# EAGLE schematic AutoPad-R3-RevA (EAGLE 9.5.2), part 1 of 3

## Sheet 1 of 12
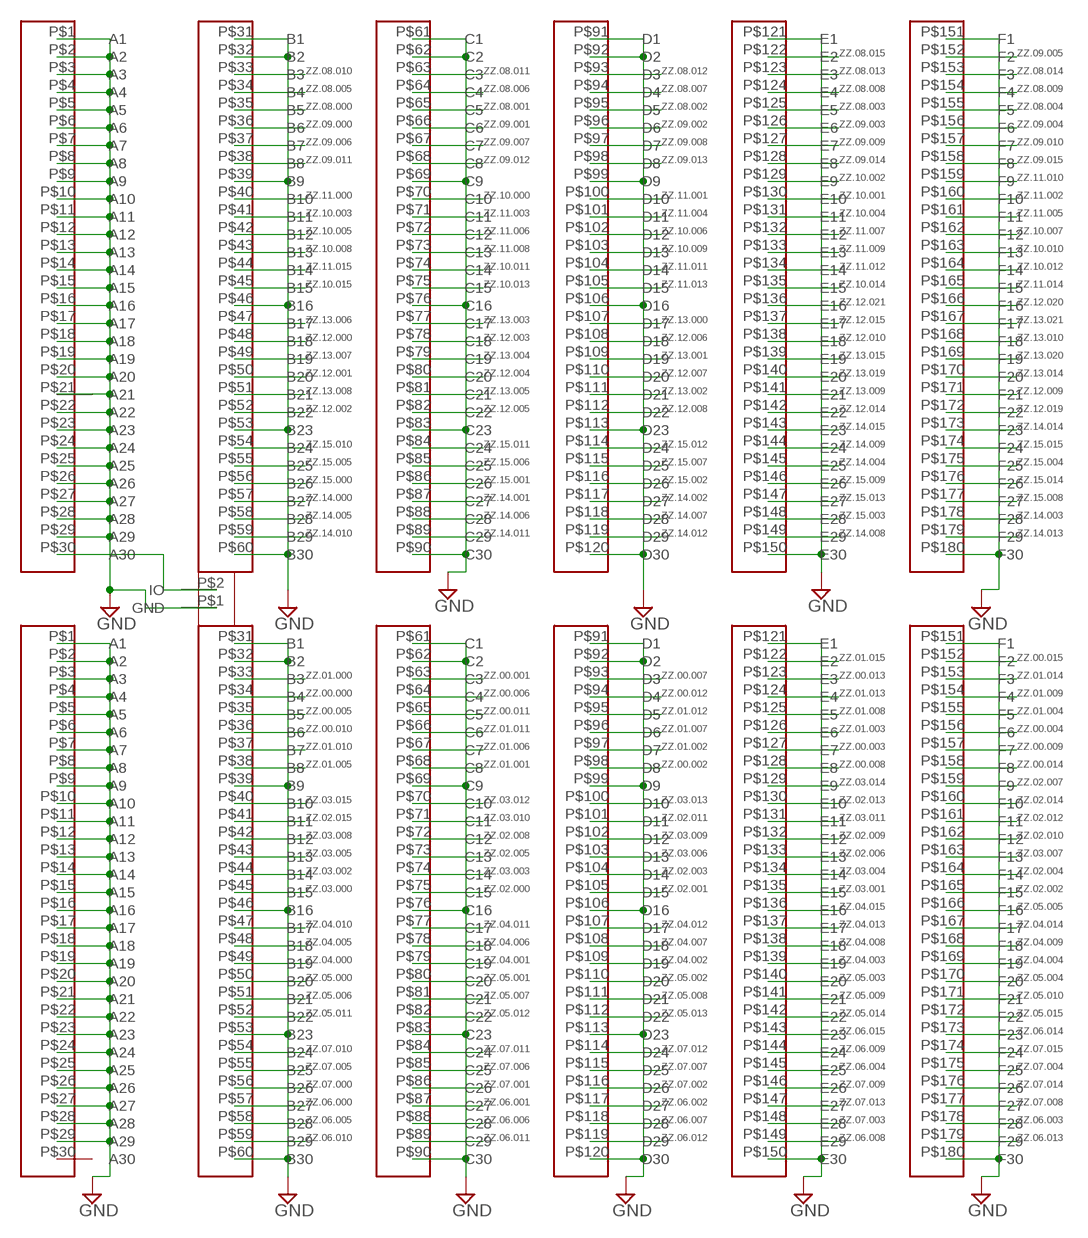
[diagram p0: schematic, sheet 1]

### Parts
U$1  SEAM-30-02.0-L-06-1-A-K-TR  [SEAM-30-02.0-L-06-1-A-K-TR]
U$2  SEAM-30-02.0-L-06-1-A-K-TR  [SEAM-30-02.0-L-06-1-A-K-TR]
U$25  DS2431  [SD2431]

### Nets
GND: U$1.P$1(A1) U$1.P$2(A2) U$1.P$3(A3) U$1.P$4(A4) U$1.P$5(A5) U$1.P$6(A6) U$1.P$7(A7) U$1.P$8(A8) U$1.P$9(A9) U$1.P$10(A10) U$1.P$11(A11) U$1.P$12(A12) U$1.P$13(A13) U$1.P$14(A14) U$1.P$15(A15) U$1.P$16(A16) U$1.P$17(A17) U$1.P$18(A18) U$1.P$19(A19) U$1.P$20(A20) U$1.P$21(A21) U$1.P$22(A22) U$1.P$23(A23) U$1.P$24(A24) U$1.P$25(A25) U$1.P$26(A26) U$1.P$27(A27) U$1.P$28(A28) U$1.P$29(A29) U$1.P$31(B1) U$1.P$32(B2) U$1.P$39(B9) U$1.P$46(B16) U$1.P$53(B23) U$1.P$60(B30) U$1.P$61(C1) U$1.P$62(C2) U$1.P$69(C9) U$1.P$76(C16) U$1.P$83(C23) U$1.P$90(C30) U$1.P$91(D1) U$1.P$92(D2) U$1.P$99(D9) U$1.P$106(D16) U$1.P$113(D23) U$1.P$120(D30) U$1.P$121(E1) U$1.P$150(E30) U$1.P$151(F1) U$1.P$180(F30) U$2.P$1(A1) U$2.P$2(A2) U$2.P$3(A3) U$2.P$4(A4) U$2.P$5(A5) U$2.P$6(A6) U$2.P$7(A7) U$2.P$8(A8) U$2.P$9(A9) U$2.P$10(A10) U$2.P$11(A11) U$2.P$12(A12) U$2.P$13(A13) U$2.P$14(A14) U$2.P$15(A15) U$2.P$16(A16) U$2.P$17(A17) U$2.P$18(A18) U$2.P$19(A19) U$2.P$20(A20) U$2.P$21(A21) U$2.P$22(A22) U$2.P$23(A23) U$2.P$24(A24) U$2.P$25(A25) U$2.P$26(A26) U$2.P$27(A27) U$2.P$28(A28) U$2.P$29(A29) U$2.P$31(B1) U$2.P$32(B2) U$2.P$39(B9) U$2.P$46(B16) U$2.P$53(B23) U$2.P$60(B30) U$2.P$61(C1) U$2.P$62(C2) U$2.P$69(C9) U$2.P$76(C16) U$2.P$83(C23) U$2.P$90(C30) U$2.P$91(D1) U$2.P$92(D2) U$2.P$99(D9) U$2.P$106(D16) U$2.P$113(D23) U$2.P$120(D30) U$2.P$121(E1) U$2.P$150(E30) U$2.P$151(F1) U$2.P$180(F30) U$25.P$1(GND) ; also sheet 2,3,4,5,6,7,8,9,10,11,12
N$1: U$1.P$30(A30) U$25.P$2(IO)
ZZ.00.000: U$2.P$34(B4)
ZZ.00.001: U$2.P$63(C3)
ZZ.00.002: U$2.P$98(D8)
ZZ.00.003: U$2.P$127(E7)
ZZ.00.004: U$2.P$156(F6)
ZZ.00.005: U$2.P$35(B5)
ZZ.00.006: U$2.P$64(C4)
ZZ.00.007: U$2.P$93(D3)
ZZ.00.008: U$2.P$128(E8)
ZZ.00.009: U$2.P$157(F7)
ZZ.00.010: U$2.P$36(B6)
ZZ.00.011: U$2.P$65(C5)
ZZ.00.012: U$2.P$94(D4)
ZZ.00.013: U$2.P$123(E3)
ZZ.00.014: U$2.P$158(F8)
ZZ.00.015: U$2.P$152(F2)
ZZ.01.000: U$2.P$33(B3)
ZZ.01.001: U$2.P$68(C8)
ZZ.01.002: U$2.P$97(D7)
ZZ.01.003: U$2.P$126(E6)
ZZ.01.004: U$2.P$155(F5)
ZZ.01.005: U$2.P$38(B8)
ZZ.01.006: U$2.P$67(C7)
ZZ.01.007: U$2.P$96(D6)
ZZ.01.008: U$2.P$125(E5)
ZZ.01.009: U$2.P$154(F4)
ZZ.01.010: U$2.P$37(B7)
ZZ.01.011: U$2.P$66(C6)
ZZ.01.012: U$2.P$95(D5)
ZZ.01.013: U$2.P$124(E4)
ZZ.01.014: U$2.P$153(F3)
ZZ.01.015: U$2.P$122(E2)
ZZ.02.000: U$2.P$75(C15)
ZZ.02.001: U$2.P$105(D15)
ZZ.02.002: U$2.P$165(F15)
ZZ.02.003: U$2.P$104(D14)
ZZ.02.004: U$2.P$164(F14)
ZZ.02.005: U$2.P$73(C13)
ZZ.02.006: U$2.P$133(E13)
ZZ.02.007: U$2.P$159(F9)
ZZ.02.008: U$2.P$72(C12)
ZZ.02.009: U$2.P$132(E12)
ZZ.02.010: U$2.P$162(F12)
ZZ.02.011: U$2.P$101(D11)
ZZ.02.012: U$2.P$161(F11)
ZZ.02.013: U$2.P$130(E10)
ZZ.02.014: U$2.P$160(F10)
ZZ.02.015: U$2.P$41(B11)
ZZ.03.000: U$2.P$45(B15)
ZZ.03.001: U$2.P$135(E15)
ZZ.03.002: U$2.P$44(B14)
ZZ.03.003: U$2.P$74(C14)
ZZ.03.004: U$2.P$134(E14)
ZZ.03.005: U$2.P$43(B13)
ZZ.03.006: U$2.P$103(D13)
ZZ.03.007: U$2.P$163(F13)
ZZ.03.008: U$2.P$42(B12)
ZZ.03.009: U$2.P$102(D12)
ZZ.03.010: U$2.P$71(C11)
ZZ.03.011: U$2.P$131(E11)
ZZ.03.012: U$2.P$70(C10)
ZZ.03.013: U$2.P$100(D10)
ZZ.03.014: U$2.P$129(E9)
ZZ.03.015: U$2.P$40(B10)
ZZ.04.000: U$2.P$49(B19)
ZZ.04.001: U$2.P$79(C19)
ZZ.04.002: U$2.P$109(D19)
ZZ.04.003: U$2.P$139(E19)
ZZ.04.004: U$2.P$169(F19)
ZZ.04.005: U$2.P$48(B18)
ZZ.04.006: U$2.P$78(C18)
ZZ.04.007: U$2.P$108(D18)
ZZ.04.008: U$2.P$138(E18)
ZZ.04.009: U$2.P$168(F18)
ZZ.04.010: U$2.P$47(B17)
ZZ.04.011: U$2.P$77(C17)
ZZ.04.012: U$2.P$107(D17)
ZZ.04.013: U$2.P$137(E17)
ZZ.04.014: U$2.P$167(F17)
ZZ.04.015: U$2.P$136(E16)
ZZ.05.000: U$2.P$50(B20)
ZZ.05.001: U$2.P$80(C20)
ZZ.05.002: U$2.P$110(D20)
ZZ.05.003: U$2.P$140(E20)
ZZ.05.004: U$2.P$170(F20)
ZZ.05.005: U$2.P$166(F16)
ZZ.05.006: U$2.P$51(B21)
ZZ.05.007: U$2.P$81(C21)
ZZ.05.008: U$2.P$111(D21)
ZZ.05.009: U$2.P$141(E21)
ZZ.05.010: U$2.P$171(F21)
ZZ.05.011: U$2.P$52(B22)
ZZ.05.012: U$2.P$82(C22)
ZZ.05.013: U$2.P$112(D22)
ZZ.05.014: U$2.P$142(E22)
ZZ.05.015: U$2.P$172(F22)
ZZ.06.000: U$2.P$57(B27)
ZZ.06.001: U$2.P$87(C27)
ZZ.06.002: U$2.P$117(D27)
ZZ.06.003: U$2.P$178(F28)
ZZ.06.004: U$2.P$145(E25)
ZZ.06.005: U$2.P$58(B28)
ZZ.06.006: U$2.P$88(C28)
ZZ.06.007: U$2.P$118(D28)
ZZ.06.008: U$2.P$149(E29)
ZZ.06.009: U$2.P$144(E24)
ZZ.06.010: U$2.P$59(B29)
ZZ.06.011: U$2.P$89(C29)
ZZ.06.012: U$2.P$119(D29)
ZZ.06.013: U$2.P$179(F29)
ZZ.06.014: U$2.P$173(F23)
ZZ.06.015: U$2.P$143(E23)
ZZ.07.000: U$2.P$56(B26)
ZZ.07.001: U$2.P$86(C26)
ZZ.07.002: U$2.P$116(D26)
ZZ.07.003: U$2.P$148(E28)
ZZ.07.004: U$2.P$175(F25)
ZZ.07.005: U$2.P$55(B25)
ZZ.07.006: U$2.P$85(C25)
ZZ.07.007: U$2.P$115(D25)
ZZ.07.008: U$2.P$177(F27)
ZZ.07.009: U$2.P$146(E26)
ZZ.07.010: U$2.P$54(B24)
ZZ.07.011: U$2.P$84(C24)
ZZ.07.012: U$2.P$114(D24)
ZZ.07.013: U$2.P$147(E27)
ZZ.07.014: U$2.P$176(F26)
ZZ.07.015: U$2.P$174(F24)
ZZ.08.000: U$1.P$35(B5)
ZZ.08.001: U$1.P$65(C5)
ZZ.08.002: U$1.P$95(D5)
ZZ.08.003: U$1.P$125(E5)
ZZ.08.004: U$1.P$155(F5)
ZZ.08.005: U$1.P$34(B4)
ZZ.08.006: U$1.P$64(C4)
ZZ.08.007: U$1.P$94(D4)
ZZ.08.008: U$1.P$124(E4)
ZZ.08.009: U$1.P$154(F4)
ZZ.08.010: U$1.P$33(B3)
ZZ.08.011: U$1.P$63(C3)
ZZ.08.012: U$1.P$93(D3)
ZZ.08.013: U$1.P$123(E3)
ZZ.08.014: U$1.P$153(F3)
ZZ.08.015: U$1.P$122(E2)
ZZ.09.000: U$1.P$36(B6)
ZZ.09.001: U$1.P$66(C6)
ZZ.09.002: U$1.P$96(D6)
ZZ.09.003: U$1.P$126(E6)
ZZ.09.004: U$1.P$156(F6)
ZZ.09.005: U$1.P$152(F2)
ZZ.09.006: U$1.P$37(B7)
ZZ.09.007: U$1.P$67(C7)
ZZ.09.008: U$1.P$97(D7)
ZZ.09.009: U$1.P$127(E7)
ZZ.09.010: U$1.P$157(F7)
ZZ.09.011: U$1.P$38(B8)
ZZ.09.012: U$1.P$68(C8)
ZZ.09.013: U$1.P$98(D8)
ZZ.09.014: U$1.P$128(E8)
ZZ.09.015: U$1.P$158(F8)
ZZ.10.000: U$1.P$70(C10)
ZZ.10.001: U$1.P$130(E10)
ZZ.10.002: U$1.P$129(E9)
ZZ.10.003: U$1.P$41(B11)
ZZ.10.004: U$1.P$131(E11)
ZZ.10.005: U$1.P$42(B12)
ZZ.10.006: U$1.P$102(D12)
ZZ.10.007: U$1.P$162(F12)
ZZ.10.008: U$1.P$43(B13)
ZZ.10.009: U$1.P$103(D13)
ZZ.10.010: U$1.P$163(F13)
ZZ.10.011: U$1.P$74(C14)
ZZ.10.012: U$1.P$164(F14)
ZZ.10.013: U$1.P$75(C15)
ZZ.10.014: U$1.P$135(E15)
ZZ.10.015: U$1.P$45(B15)
ZZ.11.000: U$1.P$40(B10)
ZZ.11.001: U$1.P$100(D10)
ZZ.11.002: U$1.P$160(F10)
ZZ.11.003: U$1.P$71(C11)
ZZ.11.004: U$1.P$101(D11)
ZZ.11.005: U$1.P$161(F11)
ZZ.11.006: U$1.P$72(C12)
ZZ.11.007: U$1.P$132(E12)
ZZ.11.008: U$1.P$73(C13)
ZZ.11.009: U$1.P$133(E13)
ZZ.11.010: U$1.P$159(F9)
ZZ.11.011: U$1.P$104(D14)
ZZ.11.012: U$1.P$134(E14)
ZZ.11.013: U$1.P$105(D15)
ZZ.11.014: U$1.P$165(F15)
ZZ.11.015: U$1.P$44(B14)
ZZ.12.000: U$1.P$48(B18)
ZZ.12.001: U$1.P$50(B20)
ZZ.12.002: U$1.P$52(B22)
ZZ.12.003: U$1.P$78(C18)
ZZ.12.004: U$1.P$80(C20)
ZZ.12.005: U$1.P$82(C22)
ZZ.12.006: U$1.P$108(D18)
ZZ.12.007: U$1.P$110(D20)
ZZ.12.008: U$1.P$112(D22)
ZZ.12.009: U$1.P$171(F21)
ZZ.12.010: U$1.P$138(E18)
ZZ.12.014: U$1.P$142(E22)
ZZ.12.015: U$1.P$137(E17)
ZZ.12.019: U$1.P$172(F22)
ZZ.12.020: U$1.P$166(F16)
ZZ.12.021: U$1.P$136(E16)
ZZ.13.000: U$1.P$107(D17)
ZZ.13.001: U$1.P$109(D19)
ZZ.13.002: U$1.P$111(D21)
ZZ.13.003: U$1.P$77(C17)
ZZ.13.004: U$1.P$79(C19)
ZZ.13.005: U$1.P$81(C21)
ZZ.13.006: U$1.P$47(B17)
ZZ.13.007: U$1.P$49(B19)
ZZ.13.008: U$1.P$51(B21)
ZZ.13.009: U$1.P$141(E21)
ZZ.13.010: U$1.P$168(F18)
ZZ.13.014: U$1.P$170(F20)
ZZ.13.015: U$1.P$139(E19)
ZZ.13.019: U$1.P$140(E20)
ZZ.13.020: U$1.P$169(F19)
ZZ.13.021: U$1.P$167(F17)
ZZ.14.000: U$1.P$57(B27)
ZZ.14.001: U$1.P$87(C27)
ZZ.14.002: U$1.P$117(D27)
ZZ.14.003: U$1.P$178(F28)
ZZ.14.004: U$1.P$145(E25)
ZZ.14.005: U$1.P$58(B28)
ZZ.14.006: U$1.P$88(C28)
ZZ.14.007: U$1.P$118(D28)
ZZ.14.008: U$1.P$149(E29)
ZZ.14.009: U$1.P$144(E24)
ZZ.14.010: U$1.P$59(B29)
ZZ.14.011: U$1.P$89(C29)
ZZ.14.012: U$1.P$119(D29)
ZZ.14.013: U$1.P$179(F29)
ZZ.14.014: U$1.P$173(F23)
ZZ.14.015: U$1.P$143(E23)
ZZ.15.000: U$1.P$56(B26)
ZZ.15.001: U$1.P$86(C26)
ZZ.15.002: U$1.P$116(D26)
ZZ.15.003: U$1.P$148(E28)
ZZ.15.004: U$1.P$175(F25)
ZZ.15.005: U$1.P$55(B25)
ZZ.15.006: U$1.P$85(C25)
ZZ.15.007: U$1.P$115(D25)
ZZ.15.008: U$1.P$177(F27)
ZZ.15.009: U$1.P$146(E26)
ZZ.15.010: U$1.P$54(B24)
ZZ.15.011: U$1.P$84(C24)
ZZ.15.012: U$1.P$114(D24)
ZZ.15.013: U$1.P$147(E27)
ZZ.15.014: U$1.P$176(F26)
ZZ.15.015: U$1.P$174(F24)
Unconnected: U$2.P$30(A30)

## Sheet 2 of 12
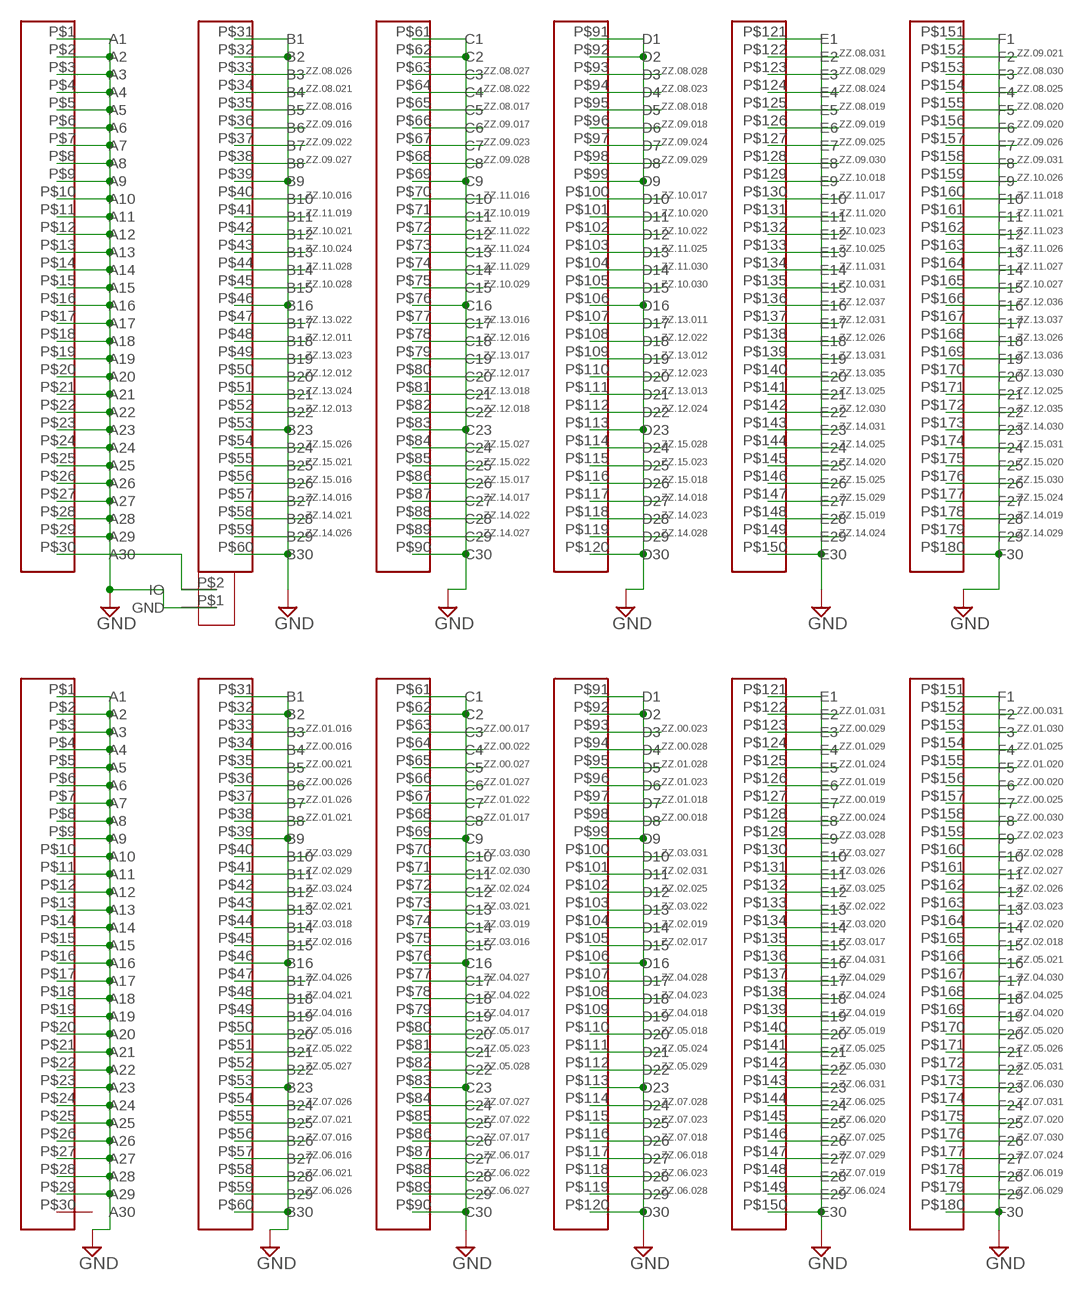
[diagram p1: schematic, sheet 2]

### Parts
U$3  SEAM-30-02.0-L-06-1-A-K-TR  [SEAM-30-02.0-L-06-1-A-K-TR]
U$4  SEAM-30-02.0-L-06-1-A-K-TR  [SEAM-30-02.0-L-06-1-A-K-TR]
U$26  DS2431  [SD2431]

### Nets
GND: U$3.P$1(A1) U$3.P$2(A2) U$3.P$3(A3) U$3.P$4(A4) U$3.P$5(A5) U$3.P$6(A6) U$3.P$7(A7) U$3.P$8(A8) U$3.P$9(A9) U$3.P$10(A10) U$3.P$11(A11) U$3.P$12(A12) U$3.P$13(A13) U$3.P$14(A14) U$3.P$15(A15) U$3.P$16(A16) U$3.P$17(A17) U$3.P$18(A18) U$3.P$19(A19) U$3.P$20(A20) U$3.P$21(A21) U$3.P$22(A22) U$3.P$23(A23) U$3.P$24(A24) U$3.P$25(A25) U$3.P$26(A26) U$3.P$27(A27) U$3.P$28(A28) U$3.P$29(A29) U$3.P$31(B1) U$3.P$32(B2) U$3.P$39(B9) U$3.P$46(B16) U$3.P$53(B23) U$3.P$60(B30) U$3.P$61(C1) U$3.P$62(C2) U$3.P$69(C9) U$3.P$76(C16) U$3.P$83(C23) U$3.P$90(C30) U$3.P$91(D1) U$3.P$92(D2) U$3.P$99(D9) U$3.P$106(D16) U$3.P$113(D23) U$3.P$120(D30) U$3.P$121(E1) U$3.P$150(E30) U$3.P$151(F1) U$3.P$180(F30) U$4.P$1(A1) U$4.P$2(A2) U$4.P$3(A3) U$4.P$4(A4) U$4.P$5(A5) U$4.P$6(A6) U$4.P$7(A7) U$4.P$8(A8) U$4.P$9(A9) U$4.P$10(A10) U$4.P$11(A11) U$4.P$12(A12) U$4.P$13(A13) U$4.P$14(A14) U$4.P$15(A15) U$4.P$16(A16) U$4.P$17(A17) U$4.P$18(A18) U$4.P$19(A19) U$4.P$20(A20) U$4.P$21(A21) U$4.P$22(A22) U$4.P$23(A23) U$4.P$24(A24) U$4.P$25(A25) U$4.P$26(A26) U$4.P$27(A27) U$4.P$28(A28) U$4.P$29(A29) U$4.P$31(B1) U$4.P$32(B2) U$4.P$39(B9) U$4.P$46(B16) U$4.P$53(B23) U$4.P$60(B30) U$4.P$61(C1) U$4.P$62(C2) U$4.P$69(C9) U$4.P$76(C16) U$4.P$83(C23) U$4.P$90(C30) U$4.P$91(D1) U$4.P$92(D2) U$4.P$99(D9) U$4.P$106(D16) U$4.P$113(D23) U$4.P$120(D30) U$4.P$121(E1) U$4.P$150(E30) U$4.P$151(F1) U$4.P$180(F30) U$26.P$1(GND) ; also sheet 1,3,4,5,6,7,8,9,10,11,12
N$2: U$3.P$30(A30) U$26.P$2(IO)
ZZ.00.016: U$4.P$34(B4)
ZZ.00.017: U$4.P$63(C3)
ZZ.00.018: U$4.P$98(D8)
ZZ.00.019: U$4.P$127(E7)
ZZ.00.020: U$4.P$156(F6)
ZZ.00.021: U$4.P$35(B5)
ZZ.00.022: U$4.P$64(C4)
ZZ.00.023: U$4.P$93(D3)
ZZ.00.024: U$4.P$128(E8)
ZZ.00.025: U$4.P$157(F7)
ZZ.00.026: U$4.P$36(B6)
ZZ.00.027: U$4.P$65(C5)
ZZ.00.028: U$4.P$94(D4)
ZZ.00.029: U$4.P$123(E3)
ZZ.00.030: U$4.P$158(F8)
ZZ.00.031: U$4.P$152(F2)
ZZ.01.016: U$4.P$33(B3)
ZZ.01.017: U$4.P$68(C8)
ZZ.01.018: U$4.P$97(D7)
ZZ.01.019: U$4.P$126(E6)
ZZ.01.020: U$4.P$155(F5)
ZZ.01.021: U$4.P$38(B8)
ZZ.01.022: U$4.P$67(C7)
ZZ.01.023: U$4.P$96(D6)
ZZ.01.024: U$4.P$125(E5)
ZZ.01.025: U$4.P$154(F4)
ZZ.01.026: U$4.P$37(B7)
ZZ.01.027: U$4.P$66(C6)
ZZ.01.028: U$4.P$95(D5)
ZZ.01.029: U$4.P$124(E4)
ZZ.01.030: U$4.P$153(F3)
ZZ.01.031: U$4.P$122(E2)
ZZ.02.016: U$4.P$45(B15)
ZZ.02.017: U$4.P$105(D15)
ZZ.02.018: U$4.P$165(F15)
ZZ.02.019: U$4.P$104(D14)
ZZ.02.020: U$4.P$164(F14)
ZZ.02.021: U$4.P$43(B13)
ZZ.02.022: U$4.P$133(E13)
ZZ.02.023: U$4.P$159(F9)
ZZ.02.024: U$4.P$72(C12)
ZZ.02.025: U$4.P$102(D12)
ZZ.02.026: U$4.P$162(F12)
ZZ.02.027: U$4.P$161(F11)
ZZ.02.028: U$4.P$160(F10)
ZZ.02.029: U$4.P$41(B11)
ZZ.02.030: U$4.P$71(C11)
ZZ.02.031: U$4.P$101(D11)
ZZ.03.016: U$4.P$75(C15)
ZZ.03.017: U$4.P$135(E15)
ZZ.03.018: U$4.P$44(B14)
ZZ.03.019: U$4.P$74(C14)
ZZ.03.020: U$4.P$134(E14)
ZZ.03.021: U$4.P$73(C13)
ZZ.03.022: U$4.P$103(D13)
ZZ.03.023: U$4.P$163(F13)
ZZ.03.024: U$4.P$42(B12)
ZZ.03.025: U$4.P$132(E12)
ZZ.03.026: U$4.P$131(E11)
ZZ.03.027: U$4.P$130(E10)
ZZ.03.028: U$4.P$129(E9)
ZZ.03.029: U$4.P$40(B10)
ZZ.03.030: U$4.P$70(C10)
ZZ.03.031: U$4.P$100(D10)
ZZ.04.016: U$4.P$49(B19)
ZZ.04.017: U$4.P$79(C19)
ZZ.04.018: U$4.P$109(D19)
ZZ.04.019: U$4.P$139(E19)
ZZ.04.020: U$4.P$169(F19)
ZZ.04.021: U$4.P$48(B18)
ZZ.04.022: U$4.P$78(C18)
ZZ.04.023: U$4.P$108(D18)
ZZ.04.024: U$4.P$138(E18)
ZZ.04.025: U$4.P$168(F18)
ZZ.04.026: U$4.P$47(B17)
ZZ.04.027: U$4.P$77(C17)
ZZ.04.028: U$4.P$107(D17)
ZZ.04.029: U$4.P$137(E17)
ZZ.04.030: U$4.P$167(F17)
ZZ.04.031: U$4.P$136(E16)
ZZ.05.016: U$4.P$50(B20)
ZZ.05.017: U$4.P$80(C20)
ZZ.05.018: U$4.P$110(D20)
ZZ.05.019: U$4.P$140(E20)
ZZ.05.020: U$4.P$170(F20)
ZZ.05.021: U$4.P$166(F16)
ZZ.05.022: U$4.P$51(B21)
ZZ.05.023: U$4.P$81(C21)
ZZ.05.024: U$4.P$111(D21)
ZZ.05.025: U$4.P$141(E21)
ZZ.05.026: U$4.P$171(F21)
ZZ.05.027: U$4.P$52(B22)
ZZ.05.028: U$4.P$82(C22)
ZZ.05.029: U$4.P$112(D22)
ZZ.05.030: U$4.P$142(E22)
ZZ.05.031: U$4.P$172(F22)
ZZ.06.016: U$4.P$57(B27)
ZZ.06.017: U$4.P$87(C27)
ZZ.06.018: U$4.P$117(D27)
ZZ.06.019: U$4.P$178(F28)
ZZ.06.020: U$4.P$145(E25)
ZZ.06.021: U$4.P$58(B28)
ZZ.06.022: U$4.P$88(C28)
ZZ.06.023: U$4.P$118(D28)
ZZ.06.024: U$4.P$149(E29)
ZZ.06.025: U$4.P$144(E24)
ZZ.06.026: U$4.P$59(B29)
ZZ.06.027: U$4.P$89(C29)
ZZ.06.028: U$4.P$119(D29)
ZZ.06.029: U$4.P$179(F29)
ZZ.06.030: U$4.P$173(F23)
ZZ.06.031: U$4.P$143(E23)
ZZ.07.016: U$4.P$56(B26)
ZZ.07.017: U$4.P$86(C26)
ZZ.07.018: U$4.P$116(D26)
ZZ.07.019: U$4.P$148(E28)
ZZ.07.020: U$4.P$175(F25)
ZZ.07.021: U$4.P$55(B25)
ZZ.07.022: U$4.P$85(C25)
ZZ.07.023: U$4.P$115(D25)
ZZ.07.024: U$4.P$177(F27)
ZZ.07.025: U$4.P$146(E26)
ZZ.07.026: U$4.P$54(B24)
ZZ.07.027: U$4.P$84(C24)
ZZ.07.028: U$4.P$114(D24)
ZZ.07.029: U$4.P$147(E27)
ZZ.07.030: U$4.P$176(F26)
ZZ.07.031: U$4.P$174(F24)
ZZ.08.016: U$3.P$35(B5)
ZZ.08.017: U$3.P$65(C5)
ZZ.08.018: U$3.P$95(D5)
ZZ.08.019: U$3.P$125(E5)
ZZ.08.020: U$3.P$155(F5)
ZZ.08.021: U$3.P$34(B4)
ZZ.08.022: U$3.P$64(C4)
ZZ.08.023: U$3.P$94(D4)
ZZ.08.024: U$3.P$124(E4)
ZZ.08.025: U$3.P$154(F4)
ZZ.08.026: U$3.P$33(B3)
ZZ.08.027: U$3.P$63(C3)
ZZ.08.028: U$3.P$93(D3)
ZZ.08.029: U$3.P$123(E3)
ZZ.08.030: U$3.P$153(F3)
ZZ.08.031: U$3.P$122(E2)
ZZ.09.016: U$3.P$36(B6)
ZZ.09.017: U$3.P$66(C6)
ZZ.09.018: U$3.P$96(D6)
ZZ.09.019: U$3.P$126(E6)
ZZ.09.020: U$3.P$156(F6)
ZZ.09.021: U$3.P$152(F2)
ZZ.09.022: U$3.P$37(B7)
ZZ.09.023: U$3.P$67(C7)
ZZ.09.024: U$3.P$97(D7)
ZZ.09.025: U$3.P$127(E7)
ZZ.09.026: U$3.P$157(F7)
ZZ.09.027: U$3.P$38(B8)
ZZ.09.028: U$3.P$68(C8)
ZZ.09.029: U$3.P$98(D8)
ZZ.09.030: U$3.P$128(E8)
ZZ.09.031: U$3.P$158(F8)
ZZ.10.016: U$3.P$40(B10)
ZZ.10.017: U$3.P$100(D10)
ZZ.10.018: U$3.P$129(E9)
ZZ.10.019: U$3.P$71(C11)
ZZ.10.020: U$3.P$101(D11)
ZZ.10.021: U$3.P$42(B12)
ZZ.10.022: U$3.P$102(D12)
ZZ.10.023: U$3.P$132(E12)
ZZ.10.024: U$3.P$43(B13)
ZZ.10.025: U$3.P$133(E13)
ZZ.10.026: U$3.P$159(F9)
ZZ.10.027: U$3.P$165(F15)
ZZ.10.028: U$3.P$45(B15)
ZZ.10.029: U$3.P$75(C15)
ZZ.10.030: U$3.P$105(D15)
ZZ.10.031: U$3.P$135(E15)
ZZ.11.016: U$3.P$70(C10)
ZZ.11.017: U$3.P$130(E10)
ZZ.11.018: U$3.P$160(F10)
ZZ.11.019: U$3.P$41(B11)
ZZ.11.020: U$3.P$131(E11)
ZZ.11.021: U$3.P$161(F11)
ZZ.11.022: U$3.P$72(C12)
ZZ.11.023: U$3.P$162(F12)
ZZ.11.024: U$3.P$73(C13)
ZZ.11.025: U$3.P$103(D13)
ZZ.11.026: U$3.P$163(F13)
ZZ.11.027: U$3.P$164(F14)
ZZ.11.028: U$3.P$44(B14)
ZZ.11.029: U$3.P$74(C14)
ZZ.11.030: U$3.P$104(D14)
ZZ.11.031: U$3.P$134(E14)
ZZ.12.011: U$3.P$48(B18)
ZZ.12.012: U$3.P$50(B20)
ZZ.12.013: U$3.P$52(B22)
ZZ.12.016: U$3.P$78(C18)
ZZ.12.017: U$3.P$80(C20)
ZZ.12.018: U$3.P$82(C22)
ZZ.12.022: U$3.P$108(D18)
ZZ.12.023: U$3.P$110(D20)
ZZ.12.024: U$3.P$112(D22)
ZZ.12.025: U$3.P$171(F21)
ZZ.12.026: U$3.P$138(E18)
ZZ.12.030: U$3.P$142(E22)
ZZ.12.031: U$3.P$137(E17)
ZZ.12.035: U$3.P$172(F22)
ZZ.12.036: U$3.P$166(F16)
ZZ.12.037: U$3.P$136(E16)
ZZ.13.011: U$3.P$107(D17)
ZZ.13.012: U$3.P$109(D19)
ZZ.13.013: U$3.P$111(D21)
ZZ.13.016: U$3.P$77(C17)
ZZ.13.017: U$3.P$79(C19)
ZZ.13.018: U$3.P$81(C21)
ZZ.13.022: U$3.P$47(B17)
ZZ.13.023: U$3.P$49(B19)
ZZ.13.024: U$3.P$51(B21)
ZZ.13.025: U$3.P$141(E21)
ZZ.13.026: U$3.P$168(F18)
ZZ.13.030: U$3.P$170(F20)
ZZ.13.031: U$3.P$139(E19)
ZZ.13.035: U$3.P$140(E20)
ZZ.13.036: U$3.P$169(F19)
ZZ.13.037: U$3.P$167(F17)
ZZ.14.016: U$3.P$57(B27)
ZZ.14.017: U$3.P$87(C27)
ZZ.14.018: U$3.P$117(D27)
ZZ.14.019: U$3.P$178(F28)
ZZ.14.020: U$3.P$145(E25)
ZZ.14.021: U$3.P$58(B28)
ZZ.14.022: U$3.P$88(C28)
ZZ.14.023: U$3.P$118(D28)
ZZ.14.024: U$3.P$149(E29)
ZZ.14.025: U$3.P$144(E24)
ZZ.14.026: U$3.P$59(B29)
ZZ.14.027: U$3.P$89(C29)
ZZ.14.028: U$3.P$119(D29)
ZZ.14.029: U$3.P$179(F29)
ZZ.14.030: U$3.P$173(F23)
ZZ.14.031: U$3.P$143(E23)
ZZ.15.016: U$3.P$56(B26)
ZZ.15.017: U$3.P$86(C26)
ZZ.15.018: U$3.P$116(D26)
ZZ.15.019: U$3.P$148(E28)
ZZ.15.020: U$3.P$175(F25)
ZZ.15.021: U$3.P$55(B25)
ZZ.15.022: U$3.P$85(C25)
ZZ.15.023: U$3.P$115(D25)
ZZ.15.024: U$3.P$177(F27)
ZZ.15.025: U$3.P$146(E26)
ZZ.15.026: U$3.P$54(B24)
ZZ.15.027: U$3.P$84(C24)
ZZ.15.028: U$3.P$114(D24)
ZZ.15.029: U$3.P$147(E27)
ZZ.15.030: U$3.P$176(F26)
ZZ.15.031: U$3.P$174(F24)
Unconnected: U$4.P$30(A30)

## Sheet 3 of 12
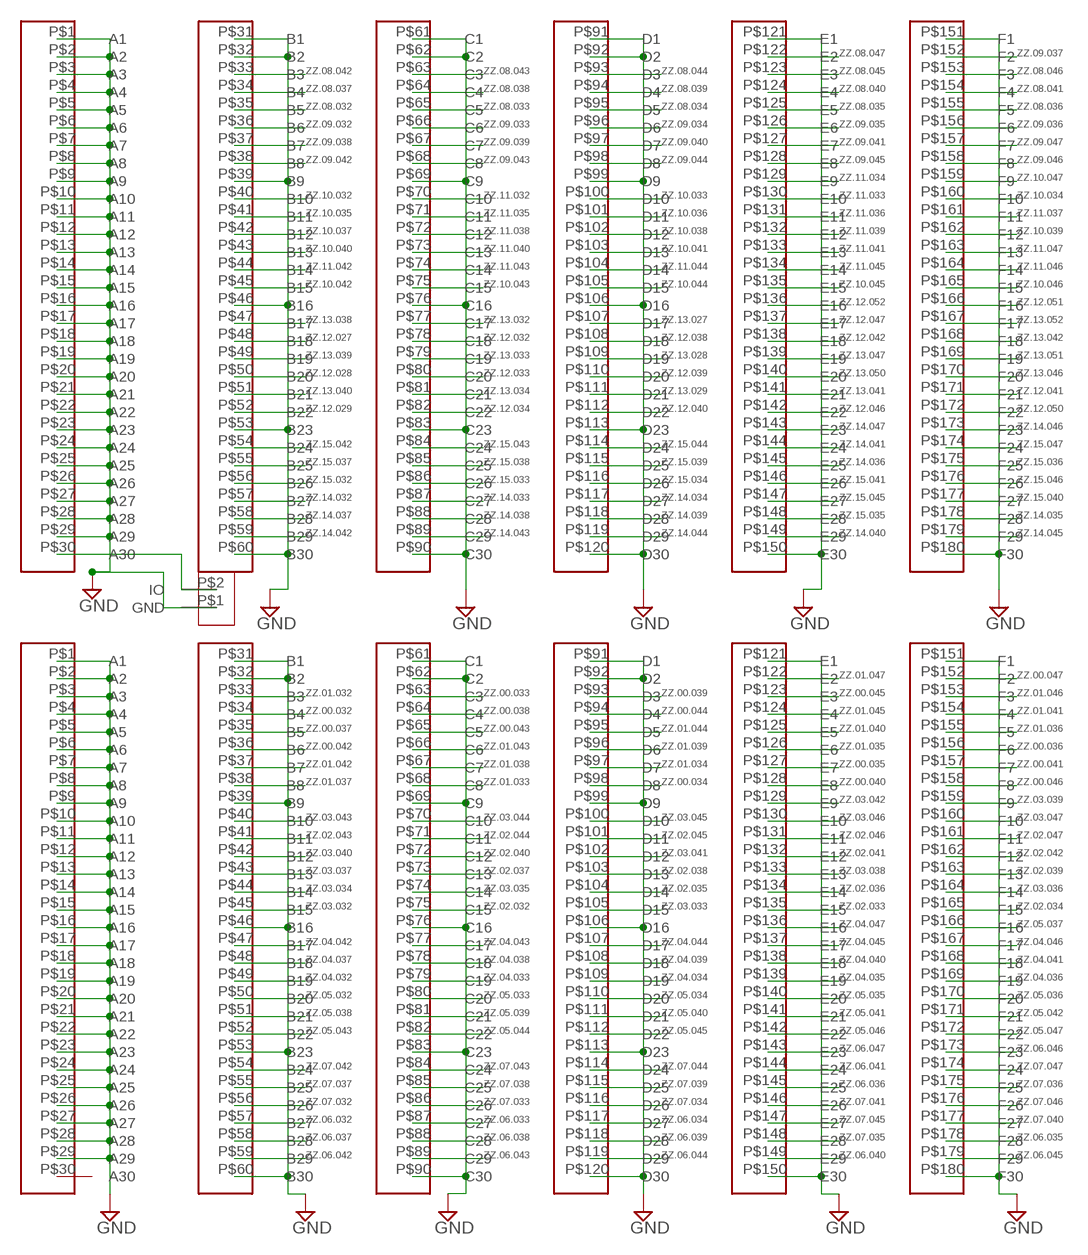
[diagram p2: schematic, sheet 3]

### Parts
U$5  SEAM-30-02.0-L-06-1-A-K-TR  [SEAM-30-02.0-L-06-1-A-K-TR]
U$6  SEAM-30-02.0-L-06-1-A-K-TR  [SEAM-30-02.0-L-06-1-A-K-TR]
U$27  DS2431  [SD2431]

### Nets
GND: U$5.P$1(A1) U$5.P$2(A2) U$5.P$3(A3) U$5.P$4(A4) U$5.P$5(A5) U$5.P$6(A6) U$5.P$7(A7) U$5.P$8(A8) U$5.P$9(A9) U$5.P$10(A10) U$5.P$11(A11) U$5.P$12(A12) U$5.P$13(A13) U$5.P$14(A14) U$5.P$15(A15) U$5.P$16(A16) U$5.P$17(A17) U$5.P$18(A18) U$5.P$19(A19) U$5.P$20(A20) U$5.P$21(A21) U$5.P$22(A22) U$5.P$23(A23) U$5.P$24(A24) U$5.P$25(A25) U$5.P$26(A26) U$5.P$27(A27) U$5.P$28(A28) U$5.P$29(A29) U$5.P$31(B1) U$5.P$32(B2) U$5.P$39(B9) U$5.P$46(B16) U$5.P$53(B23) U$5.P$60(B30) U$5.P$61(C1) U$5.P$62(C2) U$5.P$69(C9) U$5.P$76(C16) U$5.P$83(C23) U$5.P$90(C30) U$5.P$91(D1) U$5.P$92(D2) U$5.P$99(D9) U$5.P$106(D16) U$5.P$113(D23) U$5.P$120(D30) U$5.P$121(E1) U$5.P$150(E30) U$5.P$151(F1) U$5.P$180(F30) U$6.P$1(A1) U$6.P$2(A2) U$6.P$3(A3) U$6.P$4(A4) U$6.P$5(A5) U$6.P$6(A6) U$6.P$7(A7) U$6.P$8(A8) U$6.P$9(A9) U$6.P$10(A10) U$6.P$11(A11) U$6.P$12(A12) U$6.P$13(A13) U$6.P$14(A14) U$6.P$15(A15) U$6.P$16(A16) U$6.P$17(A17) U$6.P$18(A18) U$6.P$19(A19) U$6.P$20(A20) U$6.P$21(A21) U$6.P$22(A22) U$6.P$23(A23) U$6.P$24(A24) U$6.P$25(A25) U$6.P$26(A26) U$6.P$27(A27) U$6.P$28(A28) U$6.P$29(A29) U$6.P$31(B1) U$6.P$32(B2) U$6.P$39(B9) U$6.P$46(B16) U$6.P$53(B23) U$6.P$60(B30) U$6.P$61(C1) U$6.P$62(C2) U$6.P$69(C9) U$6.P$76(C16) U$6.P$83(C23) U$6.P$90(C30) U$6.P$91(D1) U$6.P$92(D2) U$6.P$99(D9) U$6.P$106(D16) U$6.P$113(D23) U$6.P$120(D30) U$6.P$121(E1) U$6.P$150(E30) U$6.P$151(F1) U$6.P$180(F30) U$27.P$1(GND) ; also sheet 1,2,4,5,6,7,8,9,10,11,12
N$3: U$5.P$30(A30) U$27.P$2(IO)
ZZ.00.032: U$6.P$34(B4)
ZZ.00.033: U$6.P$63(C3)
ZZ.00.034: U$6.P$98(D8)
ZZ.00.035: U$6.P$127(E7)
ZZ.00.036: U$6.P$156(F6)
ZZ.00.037: U$6.P$35(B5)
ZZ.00.038: U$6.P$64(C4)
ZZ.00.039: U$6.P$93(D3)
ZZ.00.040: U$6.P$128(E8)
ZZ.00.041: U$6.P$157(F7)
ZZ.00.042: U$6.P$36(B6)
ZZ.00.043: U$6.P$65(C5)
ZZ.00.044: U$6.P$94(D4)
ZZ.00.045: U$6.P$123(E3)
ZZ.00.046: U$6.P$158(F8)
ZZ.00.047: U$6.P$152(F2)
ZZ.01.032: U$6.P$33(B3)
ZZ.01.033: U$6.P$68(C8)
ZZ.01.034: U$6.P$97(D7)
ZZ.01.035: U$6.P$126(E6)
ZZ.01.036: U$6.P$155(F5)
ZZ.01.037: U$6.P$38(B8)
ZZ.01.038: U$6.P$67(C7)
ZZ.01.039: U$6.P$96(D6)
ZZ.01.040: U$6.P$125(E5)
ZZ.01.041: U$6.P$154(F4)
ZZ.01.042: U$6.P$37(B7)
ZZ.01.043: U$6.P$66(C6)
ZZ.01.044: U$6.P$95(D5)
ZZ.01.045: U$6.P$124(E4)
ZZ.01.046: U$6.P$153(F3)
ZZ.01.047: U$6.P$122(E2)
ZZ.02.032: U$6.P$75(C15)
ZZ.02.033: U$6.P$135(E15)
ZZ.02.034: U$6.P$165(F15)
ZZ.02.035: U$6.P$104(D14)
ZZ.02.036: U$6.P$134(E14)
ZZ.02.037: U$6.P$73(C13)
ZZ.02.038: U$6.P$103(D13)
ZZ.02.039: U$6.P$163(F13)
ZZ.02.040: U$6.P$72(C12)
ZZ.02.041: U$6.P$132(E12)
ZZ.02.042: U$6.P$162(F12)
ZZ.02.043: U$6.P$41(B11)
ZZ.02.044: U$6.P$71(C11)
ZZ.02.045: U$6.P$101(D11)
ZZ.02.046: U$6.P$131(E11)
ZZ.02.047: U$6.P$161(F11)
ZZ.03.032: U$6.P$45(B15)
ZZ.03.033: U$6.P$105(D15)
ZZ.03.034: U$6.P$44(B14)
ZZ.03.035: U$6.P$74(C14)
ZZ.03.036: U$6.P$164(F14)
ZZ.03.037: U$6.P$43(B13)
ZZ.03.038: U$6.P$133(E13)
ZZ.03.039: U$6.P$159(F9)
ZZ.03.040: U$6.P$42(B12)
ZZ.03.041: U$6.P$102(D12)
ZZ.03.042: U$6.P$129(E9)
ZZ.03.043: U$6.P$40(B10)
ZZ.03.044: U$6.P$70(C10)
ZZ.03.045: U$6.P$100(D10)
ZZ.03.046: U$6.P$130(E10)
ZZ.03.047: U$6.P$160(F10)
ZZ.04.032: U$6.P$49(B19)
ZZ.04.033: U$6.P$79(C19)
ZZ.04.034: U$6.P$109(D19)
ZZ.04.035: U$6.P$139(E19)
ZZ.04.036: U$6.P$169(F19)
ZZ.04.037: U$6.P$48(B18)
ZZ.04.038: U$6.P$78(C18)
ZZ.04.039: U$6.P$108(D18)
ZZ.04.040: U$6.P$138(E18)
ZZ.04.041: U$6.P$168(F18)
ZZ.04.042: U$6.P$47(B17)
ZZ.04.043: U$6.P$77(C17)
ZZ.04.044: U$6.P$107(D17)
ZZ.04.045: U$6.P$137(E17)
ZZ.04.046: U$6.P$167(F17)
ZZ.04.047: U$6.P$136(E16)
ZZ.05.032: U$6.P$50(B20)
ZZ.05.033: U$6.P$80(C20)
ZZ.05.034: U$6.P$110(D20)
ZZ.05.035: U$6.P$140(E20)
ZZ.05.036: U$6.P$170(F20)
ZZ.05.037: U$6.P$166(F16)
ZZ.05.038: U$6.P$51(B21)
ZZ.05.039: U$6.P$81(C21)
ZZ.05.040: U$6.P$111(D21)
ZZ.05.041: U$6.P$141(E21)
ZZ.05.042: U$6.P$171(F21)
ZZ.05.043: U$6.P$52(B22)
ZZ.05.044: U$6.P$82(C22)
ZZ.05.045: U$6.P$112(D22)
ZZ.05.046: U$6.P$142(E22)
ZZ.05.047: U$6.P$172(F22)
ZZ.06.032: U$6.P$57(B27)
ZZ.06.033: U$6.P$87(C27)
ZZ.06.034: U$6.P$117(D27)
ZZ.06.035: U$6.P$178(F28)
ZZ.06.036: U$6.P$145(E25)
ZZ.06.037: U$6.P$58(B28)
ZZ.06.038: U$6.P$88(C28)
ZZ.06.039: U$6.P$118(D28)
ZZ.06.040: U$6.P$149(E29)
ZZ.06.041: U$6.P$144(E24)
ZZ.06.042: U$6.P$59(B29)
ZZ.06.043: U$6.P$89(C29)
ZZ.06.044: U$6.P$119(D29)
ZZ.06.045: U$6.P$179(F29)
ZZ.06.046: U$6.P$173(F23)
ZZ.06.047: U$6.P$143(E23)
ZZ.07.032: U$6.P$56(B26)
ZZ.07.033: U$6.P$86(C26)
ZZ.07.034: U$6.P$116(D26)
ZZ.07.035: U$6.P$148(E28)
ZZ.07.036: U$6.P$175(F25)
ZZ.07.037: U$6.P$55(B25)
ZZ.07.038: U$6.P$85(C25)
ZZ.07.039: U$6.P$115(D25)
ZZ.07.040: U$6.P$177(F27)
ZZ.07.041: U$6.P$146(E26)
ZZ.07.042: U$6.P$54(B24)
ZZ.07.043: U$6.P$84(C24)
ZZ.07.044: U$6.P$114(D24)
ZZ.07.045: U$6.P$147(E27)
ZZ.07.046: U$6.P$176(F26)
ZZ.07.047: U$6.P$174(F24)
ZZ.08.032: U$5.P$35(B5)
ZZ.08.033: U$5.P$65(C5)
ZZ.08.034: U$5.P$95(D5)
ZZ.08.035: U$5.P$125(E5)
ZZ.08.036: U$5.P$155(F5)
ZZ.08.037: U$5.P$34(B4)
ZZ.08.038: U$5.P$64(C4)
ZZ.08.039: U$5.P$94(D4)
ZZ.08.040: U$5.P$124(E4)
ZZ.08.041: U$5.P$154(F4)
ZZ.08.042: U$5.P$33(B3)
ZZ.08.043: U$5.P$63(C3)
ZZ.08.044: U$5.P$93(D3)
ZZ.08.045: U$5.P$123(E3)
ZZ.08.046: U$5.P$153(F3)
ZZ.08.047: U$5.P$122(E2)
ZZ.09.032: U$5.P$36(B6)
ZZ.09.033: U$5.P$66(C6)
ZZ.09.034: U$5.P$96(D6)
ZZ.09.035: U$5.P$126(E6)
ZZ.09.036: U$5.P$156(F6)
ZZ.09.037: U$5.P$152(F2)
ZZ.09.038: U$5.P$37(B7)
ZZ.09.039: U$5.P$67(C7)
ZZ.09.040: U$5.P$97(D7)
ZZ.09.041: U$5.P$127(E7)
ZZ.09.042: U$5.P$38(B8)
ZZ.09.043: U$5.P$68(C8)
ZZ.09.044: U$5.P$98(D8)
ZZ.09.045: U$5.P$128(E8)
ZZ.09.046: U$5.P$158(F8)
ZZ.09.047: U$5.P$157(F7)
ZZ.10.032: U$5.P$40(B10)
ZZ.10.033: U$5.P$100(D10)
ZZ.10.034: U$5.P$160(F10)
ZZ.10.035: U$5.P$41(B11)
ZZ.10.036: U$5.P$101(D11)
ZZ.10.037: U$5.P$42(B12)
ZZ.10.038: U$5.P$102(D12)
ZZ.10.039: U$5.P$162(F12)
ZZ.10.040: U$5.P$43(B13)
ZZ.10.041: U$5.P$103(D13)
ZZ.10.042: U$5.P$45(B15)
ZZ.10.043: U$5.P$75(C15)
ZZ.10.044: U$5.P$105(D15)
ZZ.10.045: U$5.P$135(E15)
ZZ.10.046: U$5.P$165(F15)
ZZ.10.047: U$5.P$159(F9)
ZZ.11.032: U$5.P$70(C10)
ZZ.11.033: U$5.P$130(E10)
ZZ.11.034: U$5.P$129(E9)
ZZ.11.035: U$5.P$71(C11)
ZZ.11.036: U$5.P$131(E11)
ZZ.11.037: U$5.P$161(F11)
ZZ.11.038: U$5.P$72(C12)
ZZ.11.039: U$5.P$132(E12)
ZZ.11.040: U$5.P$73(C13)
ZZ.11.041: U$5.P$133(E13)
ZZ.11.042: U$5.P$44(B14)
ZZ.11.043: U$5.P$74(C14)
ZZ.11.044: U$5.P$104(D14)
ZZ.11.045: U$5.P$134(E14)
ZZ.11.046: U$5.P$164(F14)
ZZ.11.047: U$5.P$163(F13)
ZZ.12.027: U$5.P$48(B18)
ZZ.12.028: U$5.P$50(B20)
ZZ.12.029: U$5.P$52(B22)
ZZ.12.032: U$5.P$78(C18)
ZZ.12.033: U$5.P$80(C20)
ZZ.12.034: U$5.P$82(C22)
ZZ.12.038: U$5.P$108(D18)
ZZ.12.039: U$5.P$110(D20)
ZZ.12.040: U$5.P$112(D22)
ZZ.12.041: U$5.P$171(F21)
ZZ.12.042: U$5.P$138(E18)
ZZ.12.046: U$5.P$142(E22)
ZZ.12.047: U$5.P$137(E17)
ZZ.12.050: U$5.P$172(F22)
ZZ.12.051: U$5.P$166(F16)
ZZ.12.052: U$5.P$136(E16)
ZZ.13.027: U$5.P$107(D17)
ZZ.13.028: U$5.P$109(D19)
ZZ.13.029: U$5.P$111(D21)
ZZ.13.032: U$5.P$77(C17)
ZZ.13.033: U$5.P$79(C19)
ZZ.13.034: U$5.P$81(C21)
ZZ.13.038: U$5.P$47(B17)
ZZ.13.039: U$5.P$49(B19)
ZZ.13.040: U$5.P$51(B21)
ZZ.13.041: U$5.P$141(E21)
ZZ.13.042: U$5.P$168(F18)
ZZ.13.046: U$5.P$170(F20)
ZZ.13.047: U$5.P$139(E19)
ZZ.13.050: U$5.P$140(E20)
ZZ.13.051: U$5.P$169(F19)
ZZ.13.052: U$5.P$167(F17)
ZZ.14.032: U$5.P$57(B27)
ZZ.14.033: U$5.P$87(C27)
ZZ.14.034: U$5.P$117(D27)
ZZ.14.035: U$5.P$178(F28)
ZZ.14.036: U$5.P$145(E25)
ZZ.14.037: U$5.P$58(B28)
ZZ.14.038: U$5.P$88(C28)
ZZ.14.039: U$5.P$118(D28)
ZZ.14.040: U$5.P$149(E29)
ZZ.14.041: U$5.P$144(E24)
ZZ.14.042: U$5.P$59(B29)
ZZ.14.043: U$5.P$89(C29)
ZZ.14.044: U$5.P$119(D29)
ZZ.14.045: U$5.P$179(F29)
ZZ.14.046: U$5.P$173(F23)
ZZ.14.047: U$5.P$143(E23)
ZZ.15.032: U$5.P$56(B26)
ZZ.15.033: U$5.P$86(C26)
ZZ.15.034: U$5.P$116(D26)
ZZ.15.035: U$5.P$148(E28)
ZZ.15.036: U$5.P$175(F25)
ZZ.15.037: U$5.P$55(B25)
ZZ.15.038: U$5.P$85(C25)
ZZ.15.039: U$5.P$115(D25)
ZZ.15.040: U$5.P$177(F27)
ZZ.15.041: U$5.P$146(E26)
ZZ.15.042: U$5.P$54(B24)
ZZ.15.043: U$5.P$84(C24)
ZZ.15.044: U$5.P$114(D24)
ZZ.15.045: U$5.P$147(E27)
ZZ.15.046: U$5.P$176(F26)
ZZ.15.047: U$5.P$174(F24)
Unconnected: U$6.P$30(A30)

## Sheet 4 of 12
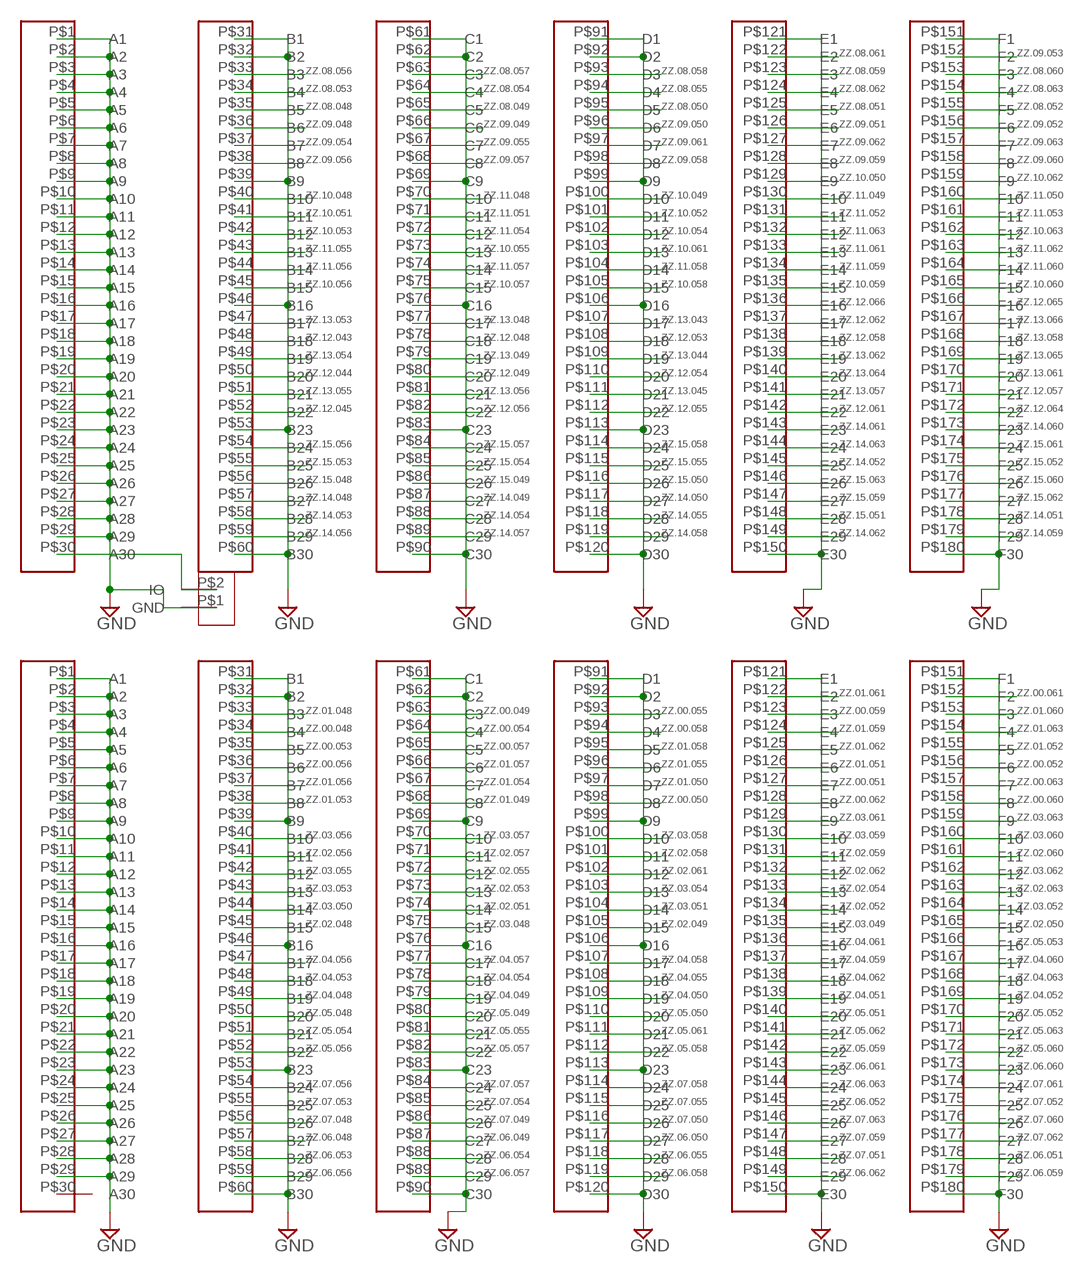
[diagram p3: schematic, sheet 4]

### Parts
U$7  SEAM-30-02.0-L-06-1-A-K-TR  [SEAM-30-02.0-L-06-1-A-K-TR]
U$8  SEAM-30-02.0-L-06-1-A-K-TR  [SEAM-30-02.0-L-06-1-A-K-TR]
U$28  DS2431  [SD2431]

### Nets
GND: U$7.P$1(A1) U$7.P$2(A2) U$7.P$3(A3) U$7.P$4(A4) U$7.P$5(A5) U$7.P$6(A6) U$7.P$7(A7) U$7.P$8(A8) U$7.P$9(A9) U$7.P$10(A10) U$7.P$11(A11) U$7.P$12(A12) U$7.P$13(A13) U$7.P$14(A14) U$7.P$15(A15) U$7.P$16(A16) U$7.P$17(A17) U$7.P$18(A18) U$7.P$19(A19) U$7.P$20(A20) U$7.P$21(A21) U$7.P$22(A22) U$7.P$23(A23) U$7.P$24(A24) U$7.P$25(A25) U$7.P$26(A26) U$7.P$27(A27) U$7.P$28(A28) U$7.P$29(A29) U$7.P$31(B1) U$7.P$32(B2) U$7.P$39(B9) U$7.P$46(B16) U$7.P$53(B23) U$7.P$60(B30) U$7.P$61(C1) U$7.P$62(C2) U$7.P$69(C9) U$7.P$76(C16) U$7.P$83(C23) U$7.P$90(C30) U$7.P$91(D1) U$7.P$92(D2) U$7.P$99(D9) U$7.P$106(D16) U$7.P$113(D23) U$7.P$120(D30) U$7.P$121(E1) U$7.P$150(E30) U$7.P$151(F1) U$7.P$180(F30) U$8.P$1(A1) U$8.P$2(A2) U$8.P$3(A3) U$8.P$4(A4) U$8.P$5(A5) U$8.P$6(A6) U$8.P$7(A7) U$8.P$8(A8) U$8.P$9(A9) U$8.P$10(A10) U$8.P$11(A11) U$8.P$12(A12) U$8.P$13(A13) U$8.P$14(A14) U$8.P$15(A15) U$8.P$16(A16) U$8.P$17(A17) U$8.P$18(A18) U$8.P$19(A19) U$8.P$20(A20) U$8.P$21(A21) U$8.P$22(A22) U$8.P$23(A23) U$8.P$24(A24) U$8.P$25(A25) U$8.P$26(A26) U$8.P$27(A27) U$8.P$28(A28) U$8.P$29(A29) U$8.P$31(B1) U$8.P$32(B2) U$8.P$39(B9) U$8.P$46(B16) U$8.P$53(B23) U$8.P$60(B30) U$8.P$61(C1) U$8.P$62(C2) U$8.P$69(C9) U$8.P$76(C16) U$8.P$83(C23) U$8.P$90(C30) U$8.P$91(D1) U$8.P$92(D2) U$8.P$99(D9) U$8.P$106(D16) U$8.P$113(D23) U$8.P$120(D30) U$8.P$121(E1) U$8.P$150(E30) U$8.P$151(F1) U$8.P$180(F30) U$28.P$1(GND) ; also sheet 1,2,3,5,6,7,8,9,10,11,12
N$4: U$7.P$30(A30) U$28.P$2(IO)
ZZ.00.048: U$8.P$34(B4)
ZZ.00.049: U$8.P$63(C3)
ZZ.00.050: U$8.P$98(D8)
ZZ.00.051: U$8.P$127(E7)
ZZ.00.052: U$8.P$156(F6)
ZZ.00.053: U$8.P$35(B5)
ZZ.00.054: U$8.P$64(C4)
ZZ.00.055: U$8.P$93(D3)
ZZ.00.056: U$8.P$36(B6)
ZZ.00.057: U$8.P$65(C5)
ZZ.00.058: U$8.P$94(D4)
ZZ.00.059: U$8.P$123(E3)
ZZ.00.060: U$8.P$158(F8)
ZZ.00.061: U$8.P$152(F2)
ZZ.00.062: U$8.P$128(E8)
ZZ.00.063: U$8.P$157(F7)
ZZ.01.048: U$8.P$33(B3)
ZZ.01.049: U$8.P$68(C8)
ZZ.01.050: U$8.P$97(D7)
ZZ.01.051: U$8.P$126(E6)
ZZ.01.052: U$8.P$155(F5)
ZZ.01.053: U$8.P$38(B8)
ZZ.01.054: U$8.P$67(C7)
ZZ.01.055: U$8.P$96(D6)
ZZ.01.056: U$8.P$37(B7)
ZZ.01.057: U$8.P$66(C6)
ZZ.01.058: U$8.P$95(D5)
ZZ.01.059: U$8.P$124(E4)
ZZ.01.060: U$8.P$153(F3)
ZZ.01.061: U$8.P$122(E2)
ZZ.01.062: U$8.P$125(E5)
ZZ.01.063: U$8.P$154(F4)
ZZ.02.048: U$8.P$45(B15)
ZZ.02.049: U$8.P$105(D15)
ZZ.02.050: U$8.P$165(F15)
ZZ.02.051: U$8.P$74(C14)
ZZ.02.052: U$8.P$134(E14)
ZZ.02.053: U$8.P$73(C13)
ZZ.02.054: U$8.P$133(E13)
ZZ.02.055: U$8.P$72(C12)
ZZ.02.056: U$8.P$41(B11)
ZZ.02.057: U$8.P$71(C11)
ZZ.02.058: U$8.P$101(D11)
ZZ.02.059: U$8.P$131(E11)
ZZ.02.060: U$8.P$161(F11)
ZZ.02.061: U$8.P$102(D12)
ZZ.02.062: U$8.P$132(E12)
ZZ.02.063: U$8.P$163(F13)
ZZ.03.048: U$8.P$75(C15)
ZZ.03.049: U$8.P$135(E15)
ZZ.03.050: U$8.P$44(B14)
ZZ.03.051: U$8.P$104(D14)
ZZ.03.052: U$8.P$164(F14)
ZZ.03.053: U$8.P$43(B13)
ZZ.03.054: U$8.P$103(D13)
ZZ.03.055: U$8.P$42(B12)
ZZ.03.056: U$8.P$40(B10)
ZZ.03.057: U$8.P$70(C10)
ZZ.03.058: U$8.P$100(D10)
ZZ.03.059: U$8.P$130(E10)
ZZ.03.060: U$8.P$160(F10)
ZZ.03.061: U$8.P$129(E9)
ZZ.03.062: U$8.P$162(F12)
ZZ.03.063: U$8.P$159(F9)
ZZ.04.048: U$8.P$49(B19)
ZZ.04.049: U$8.P$79(C19)
ZZ.04.050: U$8.P$109(D19)
ZZ.04.051: U$8.P$139(E19)
ZZ.04.052: U$8.P$169(F19)
ZZ.04.053: U$8.P$48(B18)
ZZ.04.054: U$8.P$78(C18)
ZZ.04.055: U$8.P$108(D18)
ZZ.04.056: U$8.P$47(B17)
ZZ.04.057: U$8.P$77(C17)
ZZ.04.058: U$8.P$107(D17)
ZZ.04.059: U$8.P$137(E17)
ZZ.04.060: U$8.P$167(F17)
ZZ.04.061: U$8.P$136(E16)
ZZ.04.062: U$8.P$138(E18)
ZZ.04.063: U$8.P$168(F18)
ZZ.05.048: U$8.P$50(B20)
ZZ.05.049: U$8.P$80(C20)
ZZ.05.050: U$8.P$110(D20)
ZZ.05.051: U$8.P$140(E20)
ZZ.05.052: U$8.P$170(F20)
ZZ.05.053: U$8.P$166(F16)
ZZ.05.054: U$8.P$51(B21)
ZZ.05.055: U$8.P$81(C21)
ZZ.05.056: U$8.P$52(B22)
ZZ.05.057: U$8.P$82(C22)
ZZ.05.058: U$8.P$112(D22)
ZZ.05.059: U$8.P$142(E22)
ZZ.05.060: U$8.P$172(F22)
ZZ.05.061: U$8.P$111(D21)
ZZ.05.062: U$8.P$141(E21)
ZZ.05.063: U$8.P$171(F21)
ZZ.06.048: U$8.P$57(B27)
ZZ.06.049: U$8.P$87(C27)
ZZ.06.050: U$8.P$117(D27)
ZZ.06.051: U$8.P$178(F28)
ZZ.06.052: U$8.P$145(E25)
ZZ.06.053: U$8.P$58(B28)
ZZ.06.054: U$8.P$88(C28)
ZZ.06.055: U$8.P$118(D28)
ZZ.06.056: U$8.P$59(B29)
ZZ.06.057: U$8.P$89(C29)
ZZ.06.058: U$8.P$119(D29)
ZZ.06.059: U$8.P$179(F29)
ZZ.06.060: U$8.P$173(F23)
ZZ.06.061: U$8.P$143(E23)
ZZ.06.062: U$8.P$149(E29)
ZZ.06.063: U$8.P$144(E24)
ZZ.07.048: U$8.P$56(B26)
ZZ.07.049: U$8.P$86(C26)
ZZ.07.050: U$8.P$116(D26)
ZZ.07.051: U$8.P$148(E28)
ZZ.07.052: U$8.P$175(F25)
ZZ.07.053: U$8.P$55(B25)
ZZ.07.054: U$8.P$85(C25)
ZZ.07.055: U$8.P$115(D25)
ZZ.07.056: U$8.P$54(B24)
ZZ.07.057: U$8.P$84(C24)
ZZ.07.058: U$8.P$114(D24)
ZZ.07.059: U$8.P$147(E27)
ZZ.07.060: U$8.P$176(F26)
ZZ.07.061: U$8.P$174(F24)
ZZ.07.062: U$8.P$177(F27)
ZZ.07.063: U$8.P$146(E26)
ZZ.08.048: U$7.P$35(B5)
ZZ.08.049: U$7.P$65(C5)
ZZ.08.050: U$7.P$95(D5)
ZZ.08.051: U$7.P$125(E5)
ZZ.08.052: U$7.P$155(F5)
ZZ.08.053: U$7.P$34(B4)
ZZ.08.054: U$7.P$64(C4)
ZZ.08.055: U$7.P$94(D4)
ZZ.08.056: U$7.P$33(B3)
ZZ.08.057: U$7.P$63(C3)
ZZ.08.058: U$7.P$93(D3)
ZZ.08.059: U$7.P$123(E3)
ZZ.08.060: U$7.P$153(F3)
ZZ.08.061: U$7.P$122(E2)
ZZ.08.062: U$7.P$124(E4)
ZZ.08.063: U$7.P$154(F4)
ZZ.09.048: U$7.P$36(B6)
ZZ.09.049: U$7.P$66(C6)
ZZ.09.050: U$7.P$96(D6)
ZZ.09.051: U$7.P$126(E6)
ZZ.09.052: U$7.P$156(F6)
ZZ.09.053: U$7.P$152(F2)
ZZ.09.054: U$7.P$37(B7)
ZZ.09.055: U$7.P$67(C7)
ZZ.09.056: U$7.P$38(B8)
ZZ.09.057: U$7.P$68(C8)
ZZ.09.058: U$7.P$98(D8)
ZZ.09.059: U$7.P$128(E8)
ZZ.09.060: U$7.P$158(F8)
ZZ.09.061: U$7.P$97(D7)
ZZ.09.062: U$7.P$127(E7)
ZZ.09.063: U$7.P$157(F7)
ZZ.10.048: U$7.P$40(B10)
ZZ.10.049: U$7.P$100(D10)
ZZ.10.050: U$7.P$129(E9)
ZZ.10.051: U$7.P$41(B11)
ZZ.10.052: U$7.P$101(D11)
ZZ.10.053: U$7.P$42(B12)
ZZ.10.054: U$7.P$102(D12)
ZZ.10.055: U$7.P$73(C13)
ZZ.10.056: U$7.P$45(B15)
ZZ.10.057: U$7.P$75(C15)
ZZ.10.058: U$7.P$105(D15)
ZZ.10.059: U$7.P$135(E15)
ZZ.10.060: U$7.P$165(F15)
ZZ.10.061: U$7.P$103(D13)
ZZ.10.062: U$7.P$159(F9)
ZZ.10.063: U$7.P$162(F12)
ZZ.11.048: U$7.P$70(C10)
ZZ.11.049: U$7.P$130(E10)
ZZ.11.050: U$7.P$160(F10)
ZZ.11.051: U$7.P$71(C11)
ZZ.11.052: U$7.P$131(E11)
ZZ.11.053: U$7.P$161(F11)
ZZ.11.054: U$7.P$72(C12)
ZZ.11.055: U$7.P$43(B13)
ZZ.11.056: U$7.P$44(B14)
ZZ.11.057: U$7.P$74(C14)
ZZ.11.058: U$7.P$104(D14)
ZZ.11.059: U$7.P$134(E14)
ZZ.11.060: U$7.P$164(F14)
ZZ.11.061: U$7.P$133(E13)
ZZ.11.062: U$7.P$163(F13)
ZZ.11.063: U$7.P$132(E12)
ZZ.12.043: U$7.P$48(B18)
ZZ.12.044: U$7.P$50(B20)
ZZ.12.045: U$7.P$52(B22)
ZZ.12.048: U$7.P$78(C18)
ZZ.12.049: U$7.P$80(C20)
ZZ.12.053: U$7.P$108(D18)
ZZ.12.054: U$7.P$110(D20)
ZZ.12.055: U$7.P$112(D22)
ZZ.12.056: U$7.P$82(C22)
ZZ.12.057: U$7.P$171(F21)
ZZ.12.058: U$7.P$138(E18)
ZZ.12.061: U$7.P$142(E22)
ZZ.12.062: U$7.P$137(E17)
ZZ.12.064: U$7.P$172(F22)
ZZ.12.065: U$7.P$166(F16)
ZZ.12.066: U$7.P$136(E16)
ZZ.13.043: U$7.P$107(D17)
ZZ.13.044: U$7.P$109(D19)
ZZ.13.045: U$7.P$111(D21)
ZZ.13.048: U$7.P$77(C17)
ZZ.13.049: U$7.P$79(C19)
ZZ.13.053: U$7.P$47(B17)
ZZ.13.054: U$7.P$49(B19)
ZZ.13.055: U$7.P$51(B21)
ZZ.13.056: U$7.P$81(C21)
ZZ.13.057: U$7.P$141(E21)
ZZ.13.058: U$7.P$168(F18)
ZZ.13.061: U$7.P$170(F20)
ZZ.13.062: U$7.P$139(E19)
ZZ.13.064: U$7.P$140(E20)
ZZ.13.065: U$7.P$169(F19)
ZZ.13.066: U$7.P$167(F17)
ZZ.14.048: U$7.P$57(B27)
ZZ.14.049: U$7.P$87(C27)
ZZ.14.050: U$7.P$117(D27)
ZZ.14.051: U$7.P$178(F28)
ZZ.14.052: U$7.P$145(E25)
ZZ.14.053: U$7.P$58(B28)
ZZ.14.054: U$7.P$88(C28)
ZZ.14.055: U$7.P$118(D28)
ZZ.14.056: U$7.P$59(B29)
ZZ.14.057: U$7.P$89(C29)
ZZ.14.058: U$7.P$119(D29)
ZZ.14.059: U$7.P$179(F29)
ZZ.14.060: U$7.P$173(F23)
ZZ.14.061: U$7.P$143(E23)
ZZ.14.062: U$7.P$149(E29)
ZZ.14.063: U$7.P$144(E24)
ZZ.15.048: U$7.P$56(B26)
ZZ.15.049: U$7.P$86(C26)
ZZ.15.050: U$7.P$116(D26)
ZZ.15.051: U$7.P$148(E28)
ZZ.15.052: U$7.P$175(F25)
ZZ.15.053: U$7.P$55(B25)
ZZ.15.054: U$7.P$85(C25)
ZZ.15.055: U$7.P$115(D25)
ZZ.15.056: U$7.P$54(B24)
ZZ.15.057: U$7.P$84(C24)
ZZ.15.058: U$7.P$114(D24)
ZZ.15.059: U$7.P$147(E27)
ZZ.15.060: U$7.P$176(F26)
ZZ.15.061: U$7.P$174(F24)
ZZ.15.062: U$7.P$177(F27)
ZZ.15.063: U$7.P$146(E26)
Unconnected: U$8.P$30(A30)

## Sheet 5 of 12
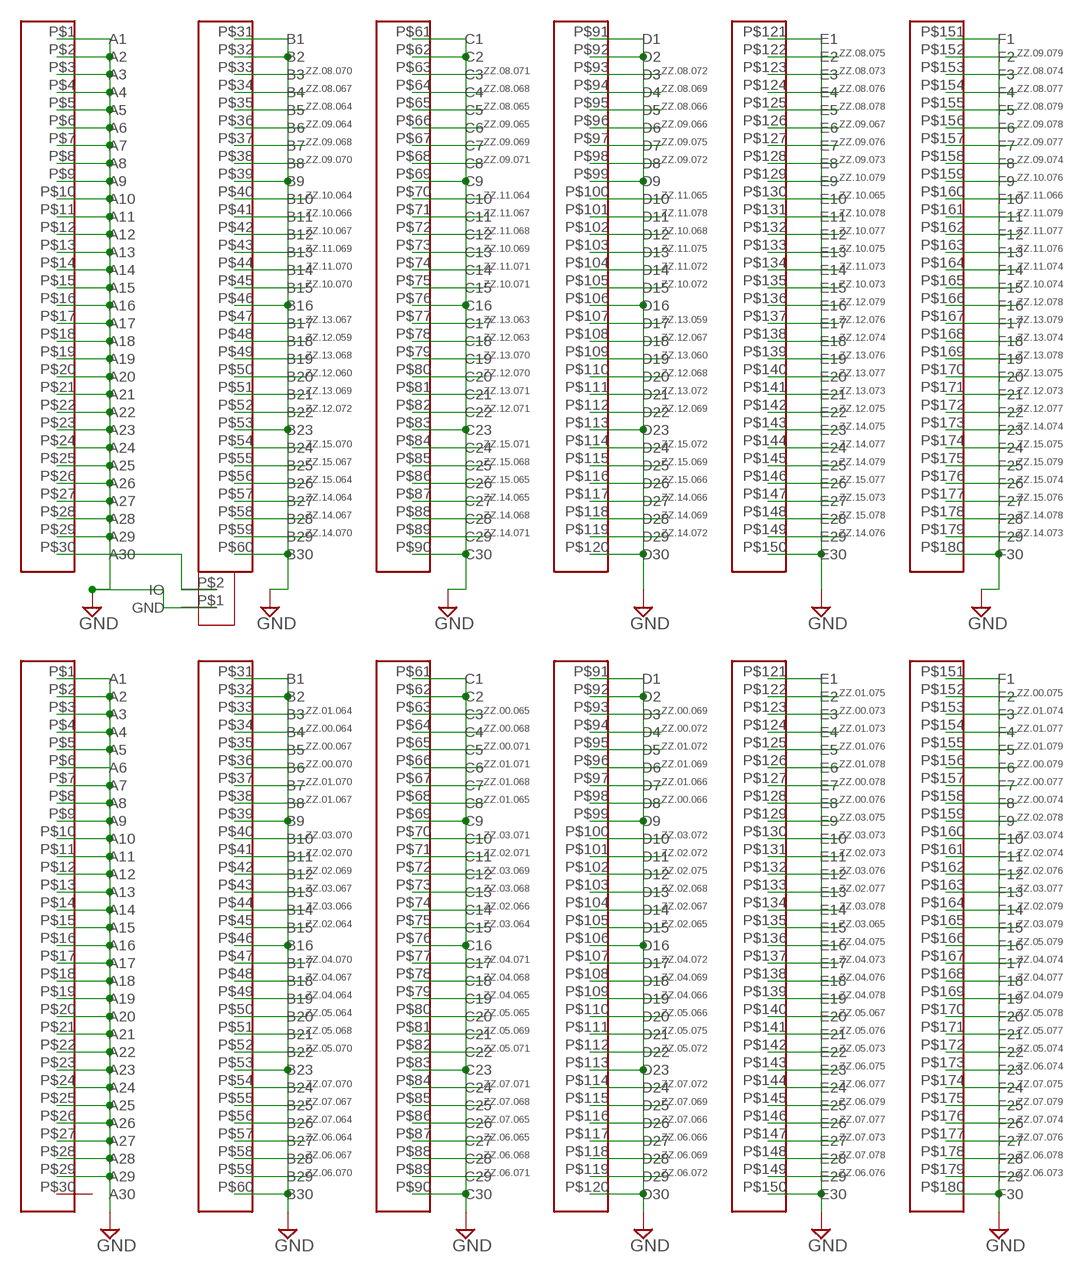
[diagram p4: schematic, sheet 5]

### Parts
U$9  SEAM-30-02.0-L-06-1-A-K-TR  [SEAM-30-02.0-L-06-1-A-K-TR]
U$10  SEAM-30-02.0-L-06-1-A-K-TR  [SEAM-30-02.0-L-06-1-A-K-TR]
U$29  DS2431  [SD2431]

### Nets
GND: U$9.P$1(A1) U$9.P$2(A2) U$9.P$3(A3) U$9.P$4(A4) U$9.P$5(A5) U$9.P$6(A6) U$9.P$7(A7) U$9.P$8(A8) U$9.P$9(A9) U$9.P$10(A10) U$9.P$11(A11) U$9.P$12(A12) U$9.P$13(A13) U$9.P$14(A14) U$9.P$15(A15) U$9.P$16(A16) U$9.P$17(A17) U$9.P$18(A18) U$9.P$19(A19) U$9.P$20(A20) U$9.P$21(A21) U$9.P$22(A22) U$9.P$23(A23) U$9.P$24(A24) U$9.P$25(A25) U$9.P$26(A26) U$9.P$27(A27) U$9.P$28(A28) U$9.P$29(A29) U$9.P$31(B1) U$9.P$32(B2) U$9.P$39(B9) U$9.P$46(B16) U$9.P$53(B23) U$9.P$60(B30) U$9.P$61(C1) U$9.P$62(C2) U$9.P$69(C9) U$9.P$76(C16) U$9.P$83(C23) U$9.P$90(C30) U$9.P$91(D1) U$9.P$92(D2) U$9.P$99(D9) U$9.P$106(D16) U$9.P$113(D23) U$9.P$120(D30) U$9.P$121(E1) U$9.P$150(E30) U$9.P$151(F1) U$9.P$180(F30) U$10.P$1(A1) U$10.P$2(A2) U$10.P$3(A3) U$10.P$4(A4) U$10.P$5(A5) U$10.P$6(A6) U$10.P$7(A7) U$10.P$8(A8) U$10.P$9(A9) U$10.P$10(A10) U$10.P$11(A11) U$10.P$12(A12) U$10.P$13(A13) U$10.P$14(A14) U$10.P$15(A15) U$10.P$16(A16) U$10.P$17(A17) U$10.P$18(A18) U$10.P$19(A19) U$10.P$20(A20) U$10.P$21(A21) U$10.P$22(A22) U$10.P$23(A23) U$10.P$24(A24) U$10.P$25(A25) U$10.P$26(A26) U$10.P$27(A27) U$10.P$28(A28) U$10.P$29(A29) U$10.P$31(B1) U$10.P$32(B2) U$10.P$39(B9) U$10.P$46(B16) U$10.P$53(B23) U$10.P$60(B30) U$10.P$61(C1) U$10.P$62(C2) U$10.P$69(C9) U$10.P$76(C16) U$10.P$83(C23) U$10.P$90(C30) U$10.P$91(D1) U$10.P$92(D2) U$10.P$99(D9) U$10.P$106(D16) U$10.P$113(D23) U$10.P$120(D30) U$10.P$121(E1) U$10.P$150(E30) U$10.P$151(F1) U$10.P$180(F30) U$29.P$1(GND) ; also sheet 1,2,3,4,6,7,8,9,10,11,12
N$5: U$9.P$30(A30) U$29.P$2(IO)
ZZ.00.064: U$10.P$34(B4)
ZZ.00.065: U$10.P$63(C3)
ZZ.00.066: U$10.P$98(D8)
ZZ.00.067: U$10.P$35(B5)
ZZ.00.068: U$10.P$64(C4)
ZZ.00.069: U$10.P$93(D3)
ZZ.00.070: U$10.P$36(B6)
ZZ.00.071: U$10.P$65(C5)
ZZ.00.072: U$10.P$94(D4)
ZZ.00.073: U$10.P$123(E3)
ZZ.00.074: U$10.P$158(F8)
ZZ.00.075: U$10.P$152(F2)
ZZ.00.076: U$10.P$128(E8)
ZZ.00.077: U$10.P$157(F7)
ZZ.00.078: U$10.P$127(E7)
ZZ.00.079: U$10.P$156(F6)
ZZ.01.064: U$10.P$33(B3)
ZZ.01.065: U$10.P$68(C8)
ZZ.01.066: U$10.P$97(D7)
ZZ.01.067: U$10.P$38(B8)
ZZ.01.068: U$10.P$67(C7)
ZZ.01.069: U$10.P$96(D6)
ZZ.01.070: U$10.P$37(B7)
ZZ.01.071: U$10.P$66(C6)
ZZ.01.072: U$10.P$95(D5)
ZZ.01.073: U$10.P$124(E4)
ZZ.01.074: U$10.P$153(F3)
ZZ.01.075: U$10.P$122(E2)
ZZ.01.076: U$10.P$125(E5)
ZZ.01.077: U$10.P$154(F4)
ZZ.01.078: U$10.P$126(E6)
ZZ.01.079: U$10.P$155(F5)
ZZ.02.064: U$10.P$45(B15)
ZZ.02.065: U$10.P$105(D15)
ZZ.02.066: U$10.P$74(C14)
ZZ.02.067: U$10.P$104(D14)
ZZ.02.068: U$10.P$103(D13)
ZZ.02.069: U$10.P$42(B12)
ZZ.02.070: U$10.P$41(B11)
ZZ.02.071: U$10.P$71(C11)
ZZ.02.072: U$10.P$101(D11)
ZZ.02.073: U$10.P$131(E11)
ZZ.02.074: U$10.P$161(F11)
ZZ.02.075: U$10.P$102(D12)
ZZ.02.076: U$10.P$162(F12)
ZZ.02.077: U$10.P$133(E13)
ZZ.02.078: U$10.P$159(F9)
ZZ.02.079: U$10.P$164(F14)
ZZ.03.064: U$10.P$75(C15)
ZZ.03.065: U$10.P$135(E15)
ZZ.03.066: U$10.P$44(B14)
ZZ.03.067: U$10.P$43(B13)
ZZ.03.068: U$10.P$73(C13)
ZZ.03.069: U$10.P$72(C12)
ZZ.03.070: U$10.P$40(B10)
ZZ.03.071: U$10.P$70(C10)
ZZ.03.072: U$10.P$100(D10)
ZZ.03.073: U$10.P$130(E10)
ZZ.03.074: U$10.P$160(F10)
ZZ.03.075: U$10.P$129(E9)
ZZ.03.076: U$10.P$132(E12)
ZZ.03.077: U$10.P$163(F13)
ZZ.03.078: U$10.P$134(E14)
ZZ.03.079: U$10.P$165(F15)
ZZ.04.064: U$10.P$49(B19)
ZZ.04.065: U$10.P$79(C19)
ZZ.04.066: U$10.P$109(D19)
ZZ.04.067: U$10.P$48(B18)
ZZ.04.068: U$10.P$78(C18)
ZZ.04.069: U$10.P$108(D18)
ZZ.04.070: U$10.P$47(B17)
ZZ.04.071: U$10.P$77(C17)
ZZ.04.072: U$10.P$107(D17)
ZZ.04.073: U$10.P$137(E17)
ZZ.04.074: U$10.P$167(F17)
ZZ.04.075: U$10.P$136(E16)
ZZ.04.076: U$10.P$138(E18)
ZZ.04.077: U$10.P$168(F18)
ZZ.04.078: U$10.P$139(E19)
ZZ.04.079: U$10.P$169(F19)
ZZ.05.064: U$10.P$50(B20)
ZZ.05.065: U$10.P$80(C20)
ZZ.05.066: U$10.P$110(D20)
ZZ.05.067: U$10.P$140(E20)
ZZ.05.068: U$10.P$51(B21)
ZZ.05.069: U$10.P$81(C21)
ZZ.05.070: U$10.P$52(B22)
ZZ.05.071: U$10.P$82(C22)
ZZ.05.072: U$10.P$112(D22)
ZZ.05.073: U$10.P$142(E22)
ZZ.05.074: U$10.P$172(F22)
ZZ.05.075: U$10.P$111(D21)
ZZ.05.076: U$10.P$141(E21)
ZZ.05.077: U$10.P$171(F21)
ZZ.05.078: U$10.P$170(F20)
ZZ.05.079: U$10.P$166(F16)
ZZ.06.064: U$10.P$57(B27)
ZZ.06.065: U$10.P$87(C27)
ZZ.06.066: U$10.P$117(D27)
ZZ.06.067: U$10.P$58(B28)
ZZ.06.068: U$10.P$88(C28)
ZZ.06.069: U$10.P$118(D28)
ZZ.06.070: U$10.P$59(B29)
ZZ.06.071: U$10.P$89(C29)
ZZ.06.072: U$10.P$119(D29)
ZZ.06.073: U$10.P$179(F29)
ZZ.06.074: U$10.P$173(F23)
ZZ.06.075: U$10.P$143(E23)
ZZ.06.076: U$10.P$149(E29)
ZZ.06.077: U$10.P$144(E24)
ZZ.06.078: U$10.P$178(F28)
ZZ.06.079: U$10.P$145(E25)
ZZ.07.064: U$10.P$56(B26)
ZZ.07.065: U$10.P$86(C26)
ZZ.07.066: U$10.P$116(D26)
ZZ.07.067: U$10.P$55(B25)
ZZ.07.068: U$10.P$85(C25)
ZZ.07.069: U$10.P$115(D25)
ZZ.07.070: U$10.P$54(B24)
ZZ.07.071: U$10.P$84(C24)
ZZ.07.072: U$10.P$114(D24)
ZZ.07.073: U$10.P$147(E27)
ZZ.07.074: U$10.P$176(F26)
ZZ.07.075: U$10.P$174(F24)
ZZ.07.076: U$10.P$177(F27)
ZZ.07.077: U$10.P$146(E26)
ZZ.07.078: U$10.P$148(E28)
ZZ.07.079: U$10.P$175(F25)
ZZ.08.064: U$9.P$35(B5)
ZZ.08.065: U$9.P$65(C5)
ZZ.08.066: U$9.P$95(D5)
ZZ.08.067: U$9.P$34(B4)
ZZ.08.068: U$9.P$64(C4)
ZZ.08.069: U$9.P$94(D4)
ZZ.08.070: U$9.P$33(B3)
ZZ.08.071: U$9.P$63(C3)
ZZ.08.072: U$9.P$93(D3)
ZZ.08.073: U$9.P$123(E3)
ZZ.08.074: U$9.P$153(F3)
ZZ.08.075: U$9.P$122(E2)
ZZ.08.076: U$9.P$124(E4)
ZZ.08.077: U$9.P$154(F4)
ZZ.08.078: U$9.P$125(E5)
ZZ.08.079: U$9.P$155(F5)
ZZ.09.064: U$9.P$36(B6)
ZZ.09.065: U$9.P$66(C6)
ZZ.09.066: U$9.P$96(D6)
ZZ.09.067: U$9.P$126(E6)
ZZ.09.068: U$9.P$37(B7)
ZZ.09.069: U$9.P$67(C7)
ZZ.09.070: U$9.P$38(B8)
ZZ.09.071: U$9.P$68(C8)
ZZ.09.072: U$9.P$98(D8)
ZZ.09.073: U$9.P$128(E8)
ZZ.09.074: U$9.P$158(F8)
ZZ.09.075: U$9.P$97(D7)
ZZ.09.076: U$9.P$127(E7)
ZZ.09.077: U$9.P$157(F7)
ZZ.09.078: U$9.P$156(F6)
ZZ.09.079: U$9.P$152(F2)
ZZ.10.064: U$9.P$40(B10)
ZZ.10.065: U$9.P$130(E10)
ZZ.10.066: U$9.P$41(B11)
ZZ.10.067: U$9.P$42(B12)
ZZ.10.068: U$9.P$102(D12)
ZZ.10.069: U$9.P$73(C13)
ZZ.10.070: U$9.P$45(B15)
ZZ.10.071: U$9.P$75(C15)
ZZ.10.072: U$9.P$105(D15)
ZZ.10.073: U$9.P$135(E15)
ZZ.10.074: U$9.P$165(F15)
ZZ.10.075: U$9.P$133(E13)
ZZ.10.076: U$9.P$159(F9)
ZZ.10.077: U$9.P$132(E12)
ZZ.10.078: U$9.P$131(E11)
ZZ.10.079: U$9.P$129(E9)
ZZ.11.064: U$9.P$70(C10)
ZZ.11.065: U$9.P$100(D10)
ZZ.11.066: U$9.P$160(F10)
ZZ.11.067: U$9.P$71(C11)
ZZ.11.068: U$9.P$72(C12)
ZZ.11.069: U$9.P$43(B13)
ZZ.11.070: U$9.P$44(B14)
ZZ.11.071: U$9.P$74(C14)
ZZ.11.072: U$9.P$104(D14)
ZZ.11.073: U$9.P$134(E14)
ZZ.11.074: U$9.P$164(F14)
ZZ.11.075: U$9.P$103(D13)
ZZ.11.076: U$9.P$163(F13)
ZZ.11.077: U$9.P$162(F12)
ZZ.11.078: U$9.P$101(D11)
ZZ.11.079: U$9.P$161(F11)
ZZ.12.059: U$9.P$48(B18)
ZZ.12.060: U$9.P$50(B20)
ZZ.12.063: U$9.P$78(C18)
ZZ.12.067: U$9.P$108(D18)
ZZ.12.068: U$9.P$110(D20)
ZZ.12.069: U$9.P$112(D22)
ZZ.12.070: U$9.P$80(C20)
ZZ.12.071: U$9.P$82(C22)
ZZ.12.072: U$9.P$52(B22)
ZZ.12.073: U$9.P$171(F21)
ZZ.12.074: U$9.P$138(E18)
ZZ.12.075: U$9.P$142(E22)
ZZ.12.076: U$9.P$137(E17)
ZZ.12.077: U$9.P$172(F22)
ZZ.12.078: U$9.P$166(F16)
ZZ.12.079: U$9.P$136(E16)
ZZ.13.059: U$9.P$107(D17)
ZZ.13.060: U$9.P$109(D19)
ZZ.13.063: U$9.P$77(C17)
ZZ.13.067: U$9.P$47(B17)
ZZ.13.068: U$9.P$49(B19)
ZZ.13.069: U$9.P$51(B21)
ZZ.13.070: U$9.P$79(C19)
ZZ.13.071: U$9.P$81(C21)
ZZ.13.072: U$9.P$111(D21)
ZZ.13.073: U$9.P$141(E21)
ZZ.13.074: U$9.P$168(F18)
ZZ.13.075: U$9.P$170(F20)
ZZ.13.076: U$9.P$139(E19)
ZZ.13.077: U$9.P$140(E20)
ZZ.13.078: U$9.P$169(F19)
ZZ.13.079: U$9.P$167(F17)
ZZ.14.064: U$9.P$57(B27)
ZZ.14.065: U$9.P$87(C27)
ZZ.14.066: U$9.P$117(D27)
ZZ.14.067: U$9.P$58(B28)
ZZ.14.068: U$9.P$88(C28)
ZZ.14.069: U$9.P$118(D28)
ZZ.14.070: U$9.P$59(B29)
ZZ.14.071: U$9.P$89(C29)
ZZ.14.072: U$9.P$119(D29)
ZZ.14.073: U$9.P$179(F29)
ZZ.14.074: U$9.P$173(F23)
ZZ.14.075: U$9.P$143(E23)
ZZ.14.076: U$9.P$149(E29)
ZZ.14.077: U$9.P$144(E24)
ZZ.14.078: U$9.P$178(F28)
ZZ.14.079: U$9.P$145(E25)
ZZ.15.064: U$9.P$56(B26)
ZZ.15.065: U$9.P$86(C26)
ZZ.15.066: U$9.P$116(D26)
ZZ.15.067: U$9.P$55(B25)
ZZ.15.068: U$9.P$85(C25)
ZZ.15.069: U$9.P$115(D25)
ZZ.15.070: U$9.P$54(B24)
ZZ.15.071: U$9.P$84(C24)
ZZ.15.072: U$9.P$114(D24)
ZZ.15.073: U$9.P$147(E27)
ZZ.15.074: U$9.P$176(F26)
ZZ.15.075: U$9.P$174(F24)
ZZ.15.076: U$9.P$177(F27)
ZZ.15.077: U$9.P$146(E26)
ZZ.15.078: U$9.P$148(E28)
ZZ.15.079: U$9.P$175(F25)
Unconnected: U$10.P$30(A30)